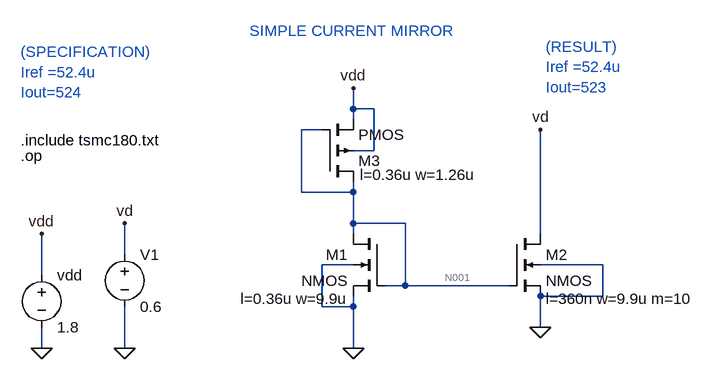
[diagram p0: schematic CurrentMirrorSimple -1.asc]
CurrentMirrorSimple -1.asc, the LTspice schematic file:
Version 4
SHEET 1 880 680
WIRE -16 0 -16 -32
WIRE 16 0 -16 0
WIRE -16 16 -16 0
WIRE -64 32 -96 32
WIRE 16 64 16 0
WIRE 16 64 -16 64
WIRE -96 128 -96 32
WIRE -16 128 -16 112
WIRE -16 128 -96 128
WIRE -16 176 -16 128
WIRE 64 176 -16 176
WIRE -16 192 -16 176
WIRE 272 192 272 32
WIRE -368 224 -368 176
WIRE -16 240 -64 240
WIRE 368 240 272 240
WIRE -496 256 -496 192
WIRE 64 272 64 176
WIRE 64 272 32 272
WIRE 224 272 64 272
WIRE 368 288 368 240
WIRE 368 288 272 288
WIRE -64 304 -64 240
WIRE -16 304 -16 288
WIRE -16 304 -64 304
WIRE 272 336 272 288
WIRE -496 368 -496 336
WIRE -368 368 -368 304
WIRE -16 368 -16 304
FLAG -16 368 0
FLAG -496 368 0
FLAG -496 192 vdd
FLAG -16 -32 vdd
FLAG 272 336 0
FLAG -368 176 vd
FLAG -368 368 0
FLAG 272 32 vd
DATAFLAG 0 176 ""
DATAFLAG 272 176 ""
SYMBOL nmos4 32 192 M0
WINDOW 123 56 100 Left 2
SYMATTR Value2 l=0.36u w=9.9u
SYMATTR InstName M1
SYMBOL voltage -496 240 R0
WINDOW 123 0 0 Left 0
WINDOW 39 0 0 Left 0
SYMATTR InstName vdd
SYMATTR Value 1.8
SYMBOL nmos4 224 192 R0
WINDOW 123 56 100 Left 2
SYMATTR Value2 l=360n w=9.9u m=10
SYMATTR InstName M2
SYMBOL voltage -368 208 R0
WINDOW 123 0 0 Left 0
WINDOW 39 0 0 Left 0
SYMATTR InstName V1
SYMATTR Value 0.6
SYMBOL pmos4 -64 112 M180
WINDOW 123 58 11 Left 2
SYMATTR Value2 l=0.36u w=1.26u
SYMATTR InstName M3
TEXT -528 48 Left 2 !.include tsmc180.txt
TEXT -528 72 Left 2 !.op
TEXT -176 -120 Left 2 ;SIMPLE CURRENT MIRROR
TEXT -528 -88 Left 2 ;(SPECIFICATION)\nIref =52.4u\nIout=524
TEXT 280 -96 Left 2 ;(RESULT)\nIref =52.4u\nIout=523

The netlist it stands for:
* CurrentMirrorSimple -1.asc
M1 N001 N001 0 0 NMOS l=0.36u w=9.9u
vdd vdd 0 1.8
M2 vd N001 0 0 NMOS l=360n w=9.9u m=10
V1 vd 0 0.6
M3 N001 N001 vdd vdd PMOS l=0.36u w=1.26u
.model NMOS NMOS
.model PMOS PMOS
.lib standard.mos
.include tsmc180.txt
.op
* SIMPLE CURRENT MIRROR
* (SPECIFICATION)
* Iref =52.4u
* Iout=524
* (RESULT)
* Iref =52.4u
* Iout=523
.backanno
.end

* Results of the author's LTspice run, read from the files saved beside the schematic
* Operating Point:
*   V(n001) = 607.4 mV
*   V(vdd) = 1.8 V
*   V(vd) = 600 mV
*   Id(M3) = -52.39 µA
*   Ig(M3) = 0 A
*   Ib(M3) = 1.203 pA
*   Is(M3) = 52.39 µA
*   Id(M2) = 523.3 µA
*   Ig(M2) = 0 A
*   Ib(M2) = -6.1 pA
*   Is(M2) = -523.3 µA
*   Id(M1) = 52.39 µA
*   Ig(M1) = 0 A
*   Ib(M1) = -617.4 fA
*   Is(M1) = -52.39 µA
*   I(V1) = -523.3 µA
*   I(Vdd) = -52.39 µA
* From the log:
*   Semiconductor Device Operating Points:
*                           --- BSIM3 MOSFETS ---
*   Name:        m3          m2          m1
*   Model:      pmos        nmos        nmos
*   Id:       -5.24e-05    5.23e-04    5.24e-05
*   Vgs:      -1.19e+00    6.07e-01    6.07e-01
*   Vds:      -1.19e+00    6.00e-01    6.07e-01
*   Vbs:       0.00e+00    0.00e+00    0.00e+00
*   Vth:      -4.68e-01    4.66e-01    4.66e-01
*   Vdsat:    -5.47e-01    1.10e-01    1.10e-01
*   Gm:        1.24e-04    8.10e-03    8.11e-04
*   Gds:       3.75e-06    7.59e-05    7.57e-06
*   Gmb        4.07e-05    2.14e-03    2.14e-04
*   Cbd:       0.00e+00    0.00e+00    0.00e+00
*   Cbs:       0.00e+00    0.00e+00    0.00e+00
*   Cgsov:     8.95e-16    7.62e-14    7.62e-15
*   Cgdov:     8.95e-16    7.62e-14    7.62e-15
*   Cgbov:     3.11e-19    3.33e-18    3.33e-19
*   dQgdVgb:   4.58e-15    3.82e-13    3.82e-14
*   dQgdVdb:  -8.96e-16   -7.63e-14   -7.63e-15
*   dQgdVsb:  -3.64e-15   -2.88e-13   -2.88e-14
*   dQddVgb:  -1.99e-15   -1.67e-13   -1.67e-14
*   dQddVdb:   8.96e-16    7.63e-14    7.63e-15
*   dQddVsb:   1.45e-15    1.17e-13    1.17e-14
*   dQbdVgb:  -5.89e-16   -4.82e-14   -4.83e-15
*   dQbdVdb:  -9.48e-19   -5.73e-17   -5.50e-18
*   dQbdVsb:  -1.52e-16   -2.30e-14   -2.30e-15